# EAGLE schematic z0-probe (EAGLE 9.4.1)
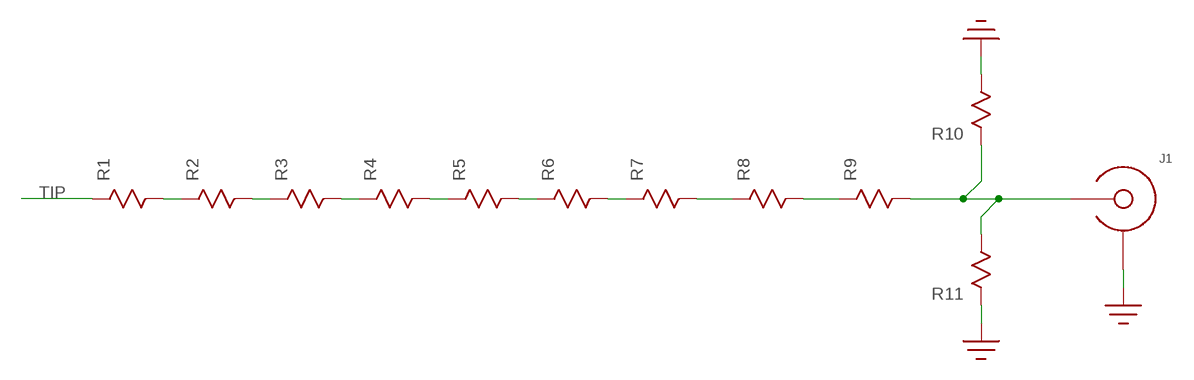
[diagram p0: schematic, sheet 1]

## Parts
J1  SMA-EDGE-LAUNCH  [SMA_EDGE_LAUNCH_2L_4020_TAPER_FIXED]
R1  R0402  [0402]
R2  R0402  [0402]
R3  R0402  [0402]
R4  R0402  [0402]
R5  R0402  [0402]
R6  R0402  [0402]
R7  R0402  [0402]
R8  R0402  [0402]
R9  R0402  [0402]
R10  R0402  [0402]
R11  R0402  [0402]

## Nets
GND: J1.BOTTOM_GND(SHIELD) J1.GND@1(SHIELD) J1.GND@2(SHIELD) J1.GND@3(SHIELD) J1.GND@4(SHIELD) J1.GND@5(SHIELD) J1.GND@6(SHIELD) J1.GND@7(SHIELD) J1.GND@8(SHIELD) J1.GND@14(SHIELD) J1.GND@15(SHIELD) J1.GND@16(SHIELD) J1.GND@17(SHIELD) J1.GND_PAD1(SHIELD) J1.GND_PAD2(SHIELD) J1.P$1(SHIELD) J1.P$2(SHIELD) R10.2 R11.1
N$1: R1.2 R2.1
N$2: R2.2 R3.1
N$3: R3.2 R4.1
N$4: R4.2 R5.1
N$5: R5.2 R6.1
N$6: R6.2 R7.1
N$7: R7.2 R8.1
N$8: R8.2 R9.1
N$9: J1.CENTER@1(CENTER) J1.P$3(CENTER) R9.2 R10.1 R11.2
TIP: R1.1

## Library data of the parts
J1 = sma_footprint_2l:SMA-EDGE-LAUNCH
R1-R11 = yapo:R